# EAGLE schematic Node (EAGLE 9.5.1)
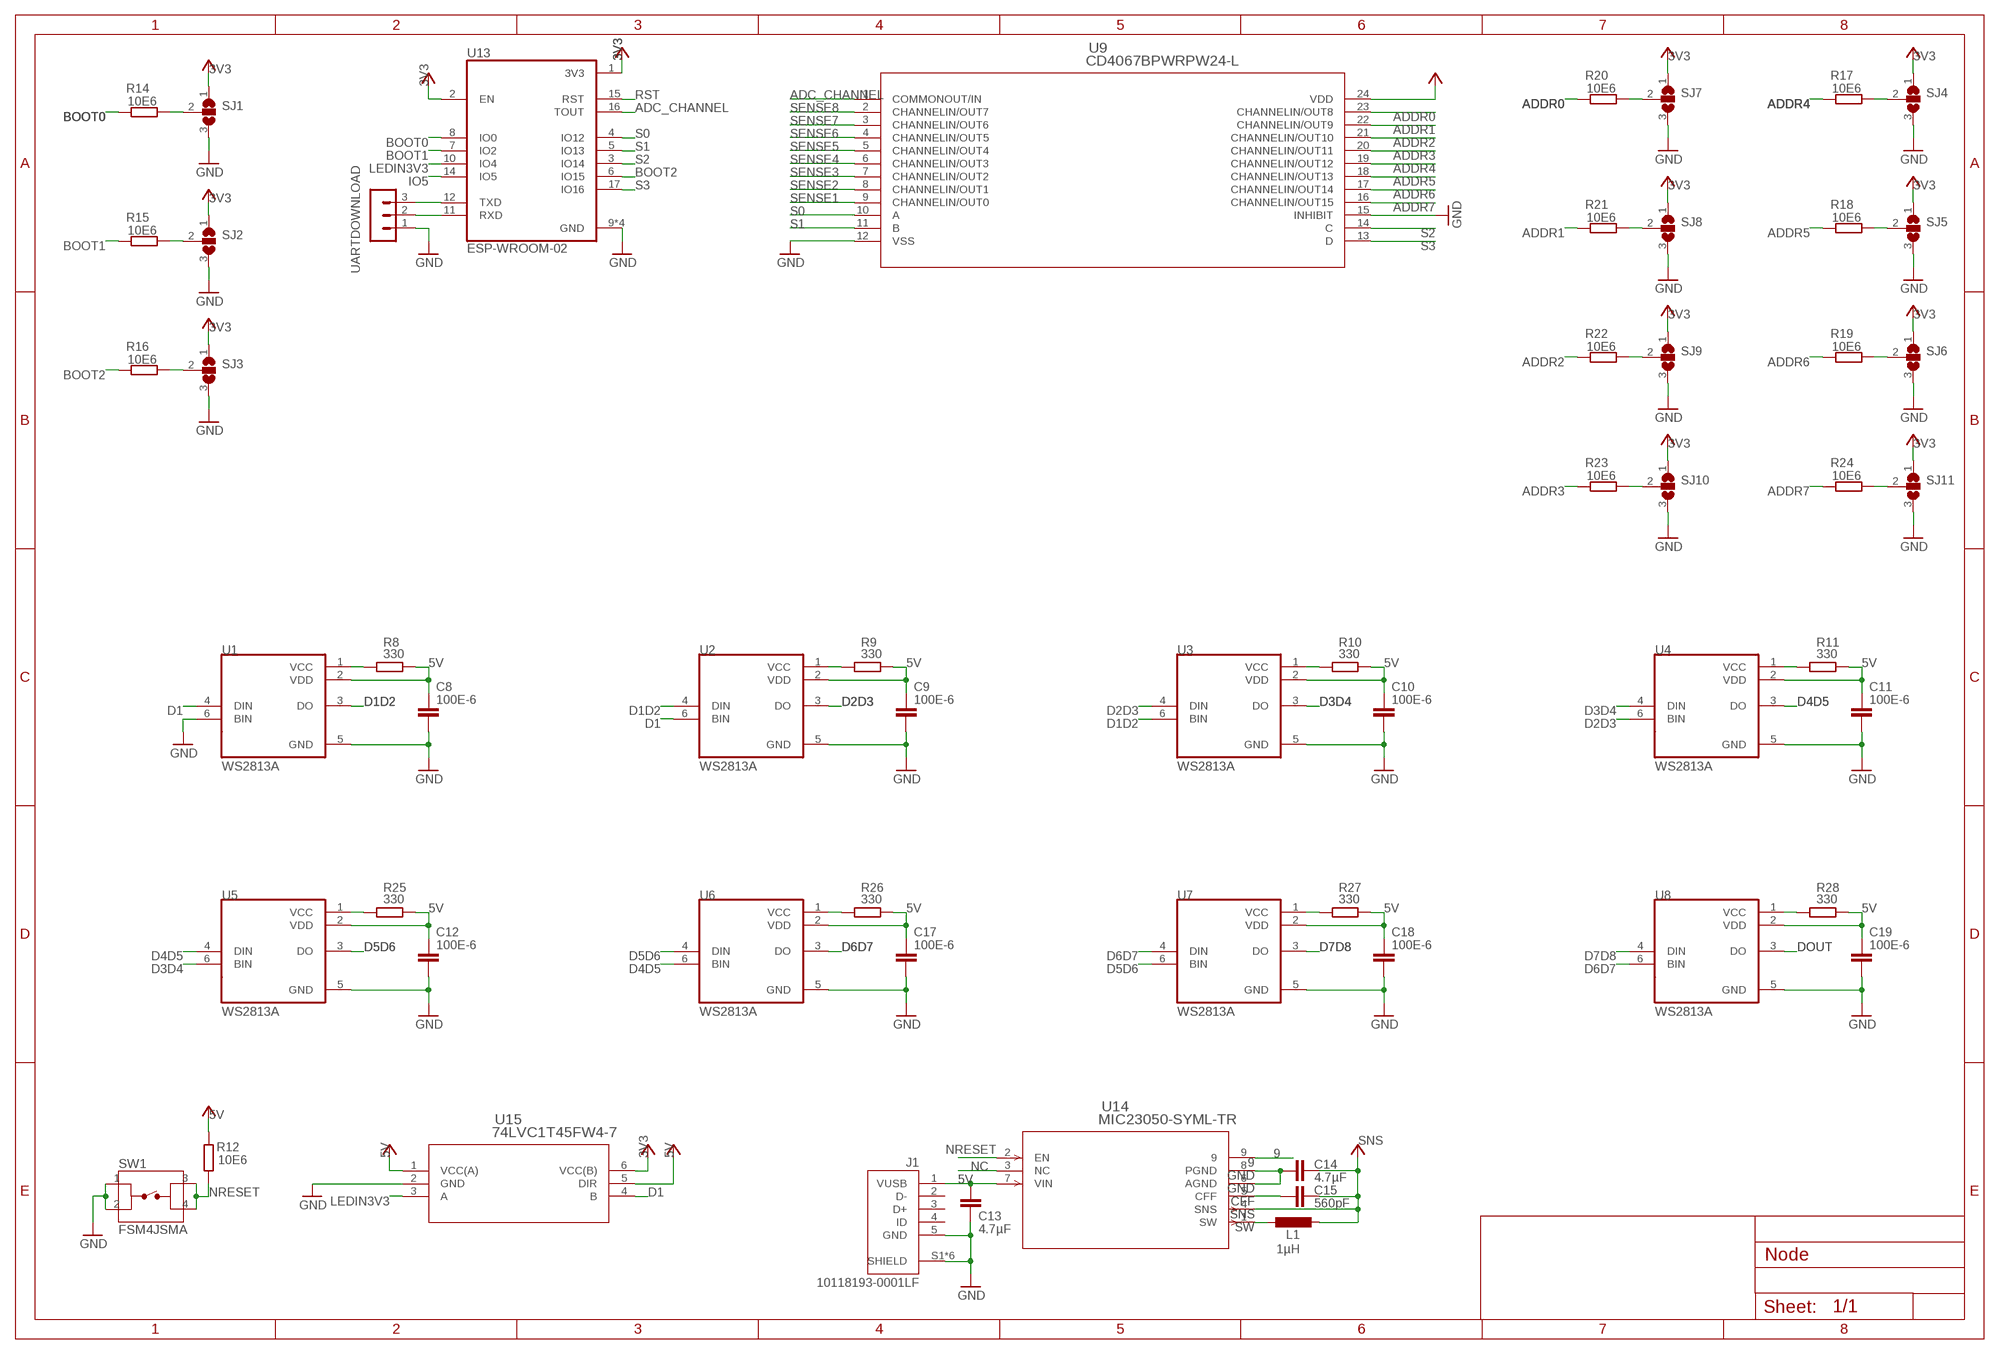
[diagram p0: schematic, sheet 1]

## Parts
C8  100E-6  C-EUC0402K  [C0402K]
C9  100E-6  C-EUC0402K  [C0402K]
C10  100E-6  C-EUC0402K  [C0402K]
C11  100E-6  C-EUC0402K  [C0402K]
C12  100E-6  C-EUC0402K  [C0402K]
C13  4.7µF  C-EUC0603  [C0603]
C14  4.7µF  C-EUC0603  [C0603]
C15  560pF  C-EUC0603  [C0603]
C17  100E-6  C-EUC0402K  [C0402K]
C18  100E-6  C-EUC0402K  [C0402K]
C19  100E-6  C-EUC0402K  [C0402K]
J1  10118193-0001LF  [FCI_10118193-0001LF]
L1  1µH  L-EUL1812  [L1812]
R8  330  R-EU_R0402  [R0402]
R9  330  R-EU_R0402  [R0402]
R10  330  R-EU_R0402  [R0402]
R11  330  R-EU_R0402  [R0402]
R12  10E6  R-EU_R0402  [R0402]
R14  10E6  R-EU_R0402  [R0402]
R15  10E6  R-EU_R0402  [R0402]
R16  10E6  R-EU_R0402  [R0402]
R17  10E6  R-EU_R0402  [R0402]
R18  10E6  R-EU_R0402  [R0402]
R19  10E6  R-EU_R0402  [R0402]
R20  10E6  R-EU_R0402  [R0402]
R21  10E6  R-EU_R0402  [R0402]
R22  10E6  R-EU_R0402  [R0402]
R23  10E6  R-EU_R0402  [R0402]
R24  10E6  R-EU_R0402  [R0402]
R25  330  R-EU_R0402  [R0402]
R26  330  R-EU_R0402  [R0402]
R27  330  R-EU_R0402  [R0402]
R28  330  R-EU_R0402  [R0402]
SJ1  SJ2W  [SJ_2]
SJ2  SJ2W  [SJ_2]
SJ3  SJ2W  [SJ_2]
SJ4  SJ2W  [SJ_2]
SJ5  SJ2W  [SJ_2]
SJ6  SJ2W  [SJ_2]
SJ7  SJ2W  [SJ_2]
SJ8  SJ2W  [SJ_2]
SJ9  SJ2W  [SJ_2]
SJ10  SJ2W  [SJ_2]
SJ11  SJ2W  [SJ_2]
SW1  FSM4JSMA  [TE_FSM4JSMA]
U1  WS2813A  [LED_WS2813A]
U2  WS2813A  [LED_WS2813A]
U3  WS2813A  [LED_WS2813A]
U4  WS2813A  [LED_WS2813A]
U5  WS2813A  [LED_WS2813A]
U6  WS2813A  [LED_WS2813A]
U7  WS2813A  [LED_WS2813A]
U8  WS2813A  [LED_WS2813A]
U9  CD4067BPWRPW24-L  [PW24-L]
U13  ESP-WROOM-02  [MODULE_ESP-WROOM-02]
U14  MIC23050-SYML-TR  [MLF-8_ML]
U15  74LVC1T45FW4-7  [X2-DFN1010-6]
UARTDOWNLOAD  MA03-1  [MA03-1]

## Nets
3V3: SJ1.1 SJ2.1 SJ3.1 SJ4.1 SJ5.1 SJ6.1 SJ7.1 SJ8.1 SJ9.1 SJ10.1 SJ11.1 U13.1(3V3) U15.6(VCC(B)) ; supply symbol labelled VCC
5V: C8.1 C13.1 J1.1(VUSB) R8.1 R12.2 U1.2(VDD) U14.7(VIN) U15.1(VCC(A)) U15.5(DIR) ; supply symbol labelled VCC
9: U14.9
ADC_CHANNEL: U9.1(COMMONOUT/IN) U13.16(TOUT)
ADDR0: R20.2 U9.23(CHANNELIN/OUT8)
ADDR1: R21.2 U9.22(CHANNELIN/OUT9)
ADDR2: R22.2 U9.21(CHANNELIN/OUT10)
ADDR3: R23.2 U9.20(CHANNELIN/OUT11)
ADDR4: R17.2 U9.19(CHANNELIN/OUT12)
ADDR5: R18.2 U9.18(CHANNELIN/OUT13)
ADDR6: R19.2 U9.17(CHANNELIN/OUT14)
ADDR7: R24.2 U9.16(CHANNELIN/OUT15)
BOOT0: R14.2 U13.8(IO0)
BOOT1: R15.2 U13.7(IO2)
BOOT2: R16.2 U13.6(IO15)
CFF: C15.1 U14.5(CFF)
D1: U1.4(DIN) U2.6(BIN) U15.4(B)
D1D2: U1.3(DO) U2.4(DIN)
D2D3: U2.3(DO) U3.4(DIN)
D3D4: U3.3(DO) U4.4(DIN)
D4D5: U4.3(DO) U5.4(DIN)
D5D6: U5.3(DO) U6.4(DIN)
D6D7: U6.3(DO) U7.4(DIN)
D7D8: U7.3(DO) U8.4(DIN)
DOUT: U8.3(DO)
GND: C8.2 C9.2 C10.2 C11.2 C12.2 C13.2 C14.1 C17.2 C18.2 C19.2 J1.5(GND) J1.S1(SHIELD) J1.S2(SHIELD) J1.S3(SHIELD) J1.S4(SHIELD) J1.S5(SHIELD) J1.S6(SHIELD) SJ1.3 SJ2.3 SJ3.3 SJ4.3 SJ5.3 SJ6.3 SJ7.3 SJ8.3 SJ9.3 SJ10.3 SJ11.3 SW1.1 SW1.2 U1.5(GND) U1.6(BIN) U2.5(GND) U3.5(GND) U4.5(GND) U5.5(GND) U6.5(GND) U7.5(GND) U8.5(GND) U9.12(VSS) U9.15(INHIBIT) U13.9(GND) U13.13(GND) U13.18(GND) U13.19(GND) U14.6(AGND) U14.8(PGND) U15.2(GND) UARTDOWNLOAD.1
IO5: U13.14(IO5)
LEDIN3V3: U13.10(IO4) U15.3(A)
N$13: R14.1 SJ1.2
N$20: R8.2 U1.1(VCC)
N$21: R9.2 U2.1(VCC)
N$22: C9.1 R9.1 U2.2(VDD)
N$23: R10.2 U3.1(VCC)
N$24: C10.1 R10.1 U3.2(VDD)
N$25: R11.2 U4.1(VCC)
N$26: C11.1 R11.1 U4.2(VDD)
N$27: R25.2 U5.1(VCC)
N$32: C12.1 R25.1 U5.2(VDD)
N$33: R26.2 U6.1(VCC)
N$36: C17.1 R26.1 U6.2(VDD)
N$38: R15.1 SJ2.2
N$40: R16.1 SJ3.2
N$42: R17.1 SJ4.2
N$43: R18.1 SJ5.2
N$44: R19.1 SJ6.2
N$45: R20.1 SJ7.2
N$46: R21.1 SJ8.2
N$47: R22.1 SJ9.2
N$48: R23.1 SJ10.2
N$49: R27.2 U7.1(VCC)
N$50: C18.1 R27.1 U7.2(VDD)
N$51: R28.2 U8.1(VCC)
N$52: C19.1 R28.1 U8.2(VDD)
N$53: U3.6(BIN)
N$54: U4.6(BIN)
N$55: U8.6(BIN)
N$56: U6.6(BIN)
N$57: R24.1 SJ11.2
N$58: U5.6(BIN)
N$59: U7.6(BIN)
NC: U14.3(NC)
NRESET: R12.1 SW1.3 SW1.4 U14.2(EN)
RST: U13.15(RST)
RX: U13.11(RXD) UARTDOWNLOAD.2
S0: U9.10(A) U13.4(IO12)
S1: U9.11(B) U13.5(IO13)
S2: U9.14(C) U13.3(IO14)
S3: U9.13(D) U13.17(IO16)
SENSE1: U9.9(CHANNELIN/OUT0)
SENSE2: U9.8(CHANNELIN/OUT1)
SENSE3: U9.7(CHANNELIN/OUT2)
SENSE4: U9.6(CHANNELIN/OUT3)
SENSE5: U9.5(CHANNELIN/OUT4)
SENSE6: U9.4(CHANNELIN/OUT5)
SENSE7: U9.3(CHANNELIN/OUT6)
SENSE8: U9.2(CHANNELIN/OUT7)
SNS: C14.2 C15.2 L1.2 U14.4(SNS) ; supply symbol labelled VCC
SW: L1.1 U14.1(SW)
TX: U13.12(TXD) UARTDOWNLOAD.3
VCC: U9.24(VDD) U13.2(EN)
Unconnected: J1.2(D-) J1.3(D+) J1.4(ID)

## Library data of the parts
C8-C15 C17-C19 = rcl:C-EU: CAPACITOR, European symbol; SPICEPREFIX: C
J1 = 10118193-0001LF:10118193-0001LF: Micro USB B Type Receptacle; DESCRIPTION: Conn Micro USB Type B RCP 5 POS 0.65mm Solder RA SMD 5 Terminal 1 Port T/R; DIGI-KEY_PART_NUMBER: 609-4616-1-ND; DIGI-KEY_PURCHASE_URL: https://www.digikey.at/product-detail/en/amphenol-icc-fci/10118193-0001LF/609-4616-1-ND/2785380?utm_source=snapeda&utm_medium=aggregator&utm_campaign=symbol; MF: Amphenol ICC; MP: 10118193-0001LF; PACKAGE: None
L1 = rcl:L-EU: INDUCTOR, European symbol; SPICEPREFIX: L
R8-R12 R14-R28 = rcl:R-EU_: RESISTOR, European symbol; SPICEPREFIX: R
SJ1-SJ11 = jumper:SJ2W: SMD solder JUMPER
SW1 = FSM4JSMA:FSM4JSMA: Switch Tactile OFF (ON) SPST Round Button Gull Wing 0.05A 24VDC 2.6N SMD T/R; COMMENT: 4-1437565-1; CONFIGURATION_POLE-THROW: Single Pole - Single Throw; CONTACT_CURRENT_RATING: 50 mA; DESCRIPTION: Switch Tactile OFF _ON_ SPST Round Button Gull Wing 0.05A 12VDC 1.57N SMD Loose Piece; DIGI-KEY_PART_NUMBER: 450-1129-ND; DIGI-KEY_PURCHASE_URL: https://www.digikey.at/product-detail/en/te-connectivity-alcoswitch-switches/FSM4JSMA/450-1129-ND/525821?utm_source=snapeda&utm_medium=aggregator&utm_campaign=symbol; EU_ROHS_COMPLIANCE: Compliant; MF: TE Connectivity; MP: FSM4JSMA; PACKAGE: None; TE_PURCHASE_URL: https://www.te.com/usa-en/product-4-1437565-1.html?te_bu=Cor&te_type=disp&te_campaign=seda_glo_cor-seda-global-disp-prtnr-fy19-seda-model-bom-cta_sma-317_1&elqCampaignId=32493
U1-U8 = WS2813A:WS2813A: Intelligent control LED integrated light source; AVAILABILITY: Unavailable; MF: Worldsemi; MP: WS2813A; PACKAGE: Package Analog Devices; PRICE: None
U9 = CD4067BPWR:CD4067BPWR; MANUFACTURER_PART_NUMBER: CD4067BPWR; VENDOR: Vendor
U13 = ESP-WROOM-02:ESP-WROOM-02: Wi-Fi Module w/ESP8266 802.11b/g/n 20dBm 20x18x3mm; DESCRIPTION: Wi-Fi Module w/ESP8266 802.11b/g/n 20dBm 20x18x3mm; DIGI-KEY_PART_NUMBER: 1904-1009-1-ND; DIGI-KEY_PURCHASE_URL: https://www.digikey.at/product-detail/en/espressif-systems/ESP-WROOM-02/1904-1009-1-ND/8544304?utm_source=snapeda&utm_medium=aggregator&utm_campaign=symbol; MF: Espressif Systems; MP: ESP-WROOM-02; PACKAGE: SMD-18 Espressif Systems
U14 = MIC23050-SYML-TR:MIC23050-SYML-TR; MANUFACTURER_PART_NUMBER: MIC23050SYMLTR; VENDOR: Microchip
U15 = 74LVC1T45FW4-7:74LVC1T45FW4-7; MANUFACTURER_PART_NUMBER: 74LVC1T45FW47; VENDOR: Diodes Inc
UARTDOWNLOAD = con-lstb:MA03-1: PIN HEADER; OC_FARNELL: unknown; OC_NEWARK: unknown